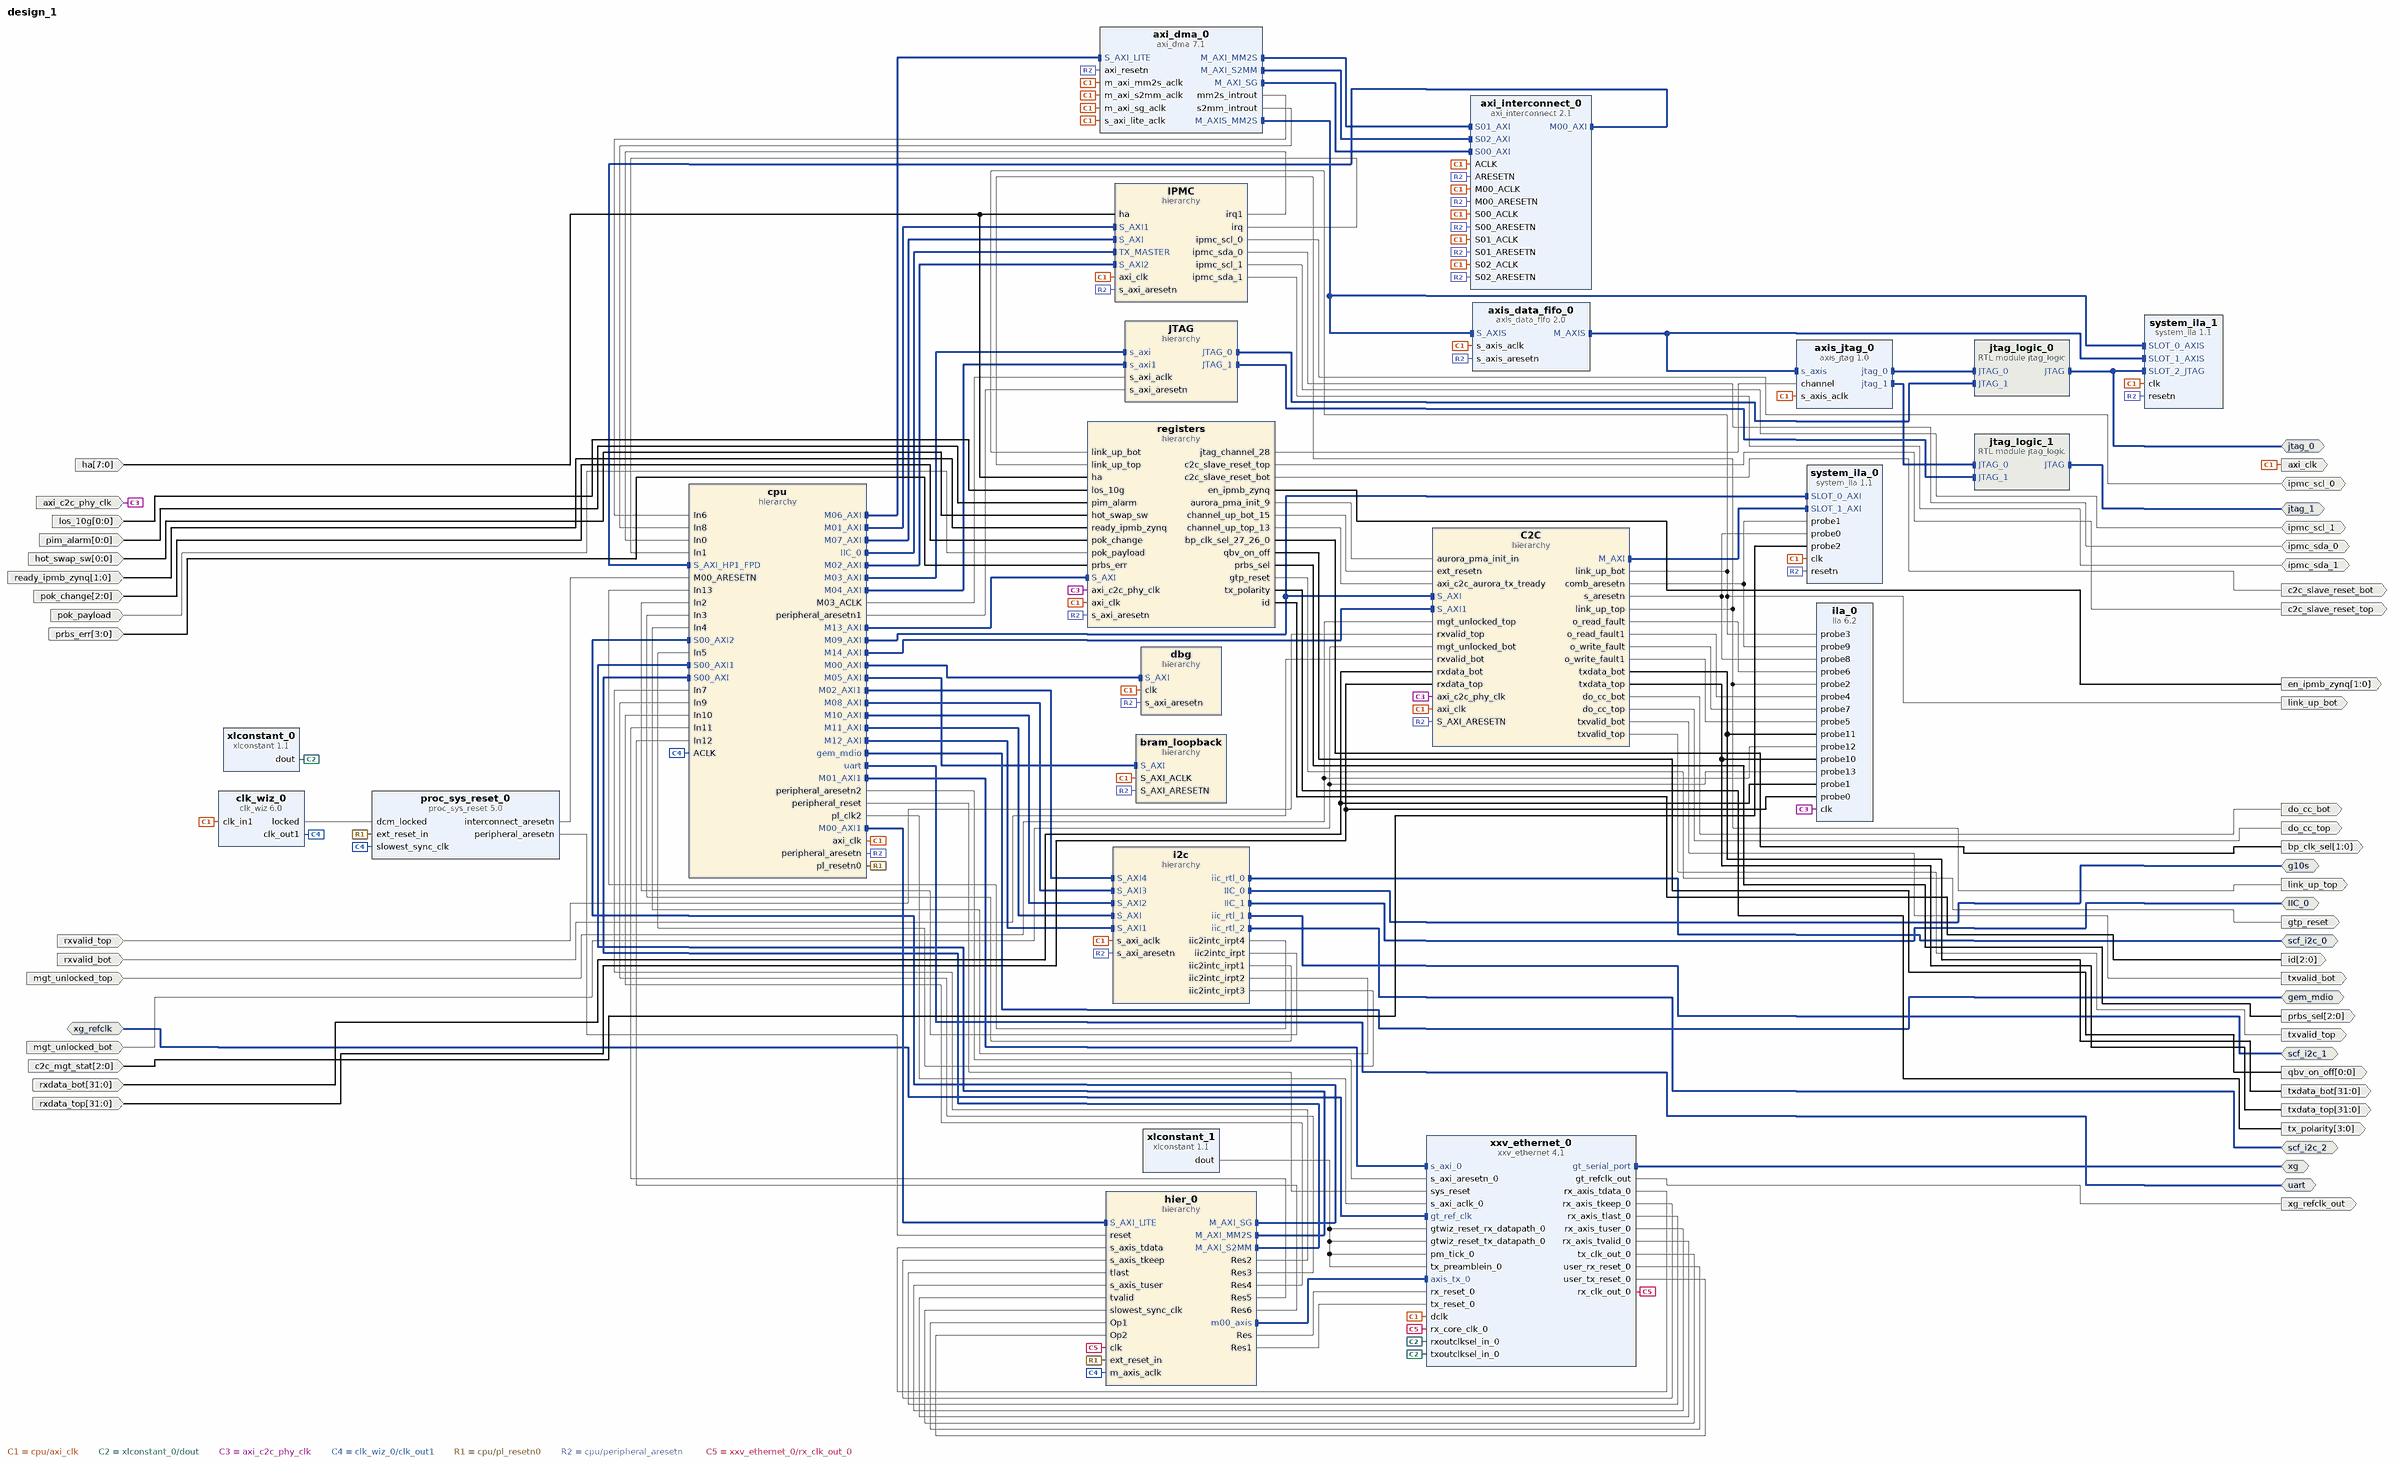
[diagram p0: block diagram of the top level]
# Vivado block design design_1, xck26-sfvc784-2LV-c, Vivado 2022.2.2
create_bd_design design_1

create_bd_intf_port -mode Master -vlnv xilinx.com:interface:iic_rtl:1.0 g10s
create_bd_intf_port -mode Master -vlnv xilinx.com:interface:mdio_rtl:1.0 gem_mdio
create_bd_intf_port -mode Master -vlnv xilinx.com:interface:jtag_rtl:2.0 jtag_0
create_bd_intf_port -mode Master -vlnv xilinx.com:interface:jtag_rtl:2.0 jtag_1
create_bd_intf_port -mode Master -vlnv xilinx.com:interface:iic_rtl:1.0 scf_i2c_0
create_bd_intf_port -mode Master -vlnv xilinx.com:interface:iic_rtl:1.0 scf_i2c_1
create_bd_intf_port -mode Master -vlnv xilinx.com:interface:iic_rtl:1.0 scf_i2c_2
create_bd_intf_port -mode Master -vlnv xilinx.com:interface:uart_rtl:1.0 uart
create_bd_intf_port -mode Master -vlnv xilinx.com:interface:gt_rtl:1.0 xg
create_bd_intf_port -mode Slave -vlnv xilinx.com:interface:diff_clock_rtl:1.0 xg_refclk
set_property -dict {CONFIG.FREQ_HZ 156250000} [get_bd_intf_ports xg_refclk]
create_bd_intf_port -mode Master -vlnv xilinx.com:interface:iic_rtl:1.0 IIC_0
create_bd_port -dir I -type clk axi_c2c_phy_clk
set_property -dict {CONFIG.FREQ_HZ 93750000 CONFIG.PHASE 0} [get_bd_ports axi_c2c_phy_clk]
create_bd_port -dir O -type clk axi_clk
create_bd_port -dir O -from 1 -to 0 bp_clk_sel
create_bd_port -dir I -from 2 -to 0 c2c_mgt_stat
create_bd_port -dir O -type rst c2c_slave_reset_bot
create_bd_port -dir O -type rst c2c_slave_reset_top
create_bd_port -dir O do_cc_bot
create_bd_port -dir O do_cc_top
create_bd_port -dir O -from 1 -to 0 en_ipmb_zynq
create_bd_port -dir O gtp_reset
create_bd_port -dir I -from 7 -to 0 ha
create_bd_port -dir I -from 0 -to 0 hot_swap_sw
create_bd_port -dir O -from 2 -to 0 id
create_bd_port -dir IO ipmc_scl_0
create_bd_port -dir IO ipmc_scl_1
create_bd_port -dir IO ipmc_sda_0
create_bd_port -dir IO ipmc_sda_1
create_bd_port -dir O link_up_bot
create_bd_port -dir O link_up_top
create_bd_port -dir I -from 0 -to 0 los_10g
create_bd_port -dir I -type rst mgt_unlocked_bot
set_property -dict {CONFIG.POLARITY ACTIVE_HIGH} [get_bd_ports mgt_unlocked_bot]
create_bd_port -dir I -type rst mgt_unlocked_top
set_property -dict {CONFIG.POLARITY ACTIVE_HIGH} [get_bd_ports mgt_unlocked_top]
create_bd_port -dir I -from 0 -to 0 pim_alarm
create_bd_port -dir I -from 2 -to 0 pok_change
create_bd_port -dir I pok_payload
create_bd_port -dir I -from 3 -to 0 prbs_err
create_bd_port -dir O -from 2 -to 0 prbs_sel
create_bd_port -dir O -from 0 -to 0 qbv_on_off
create_bd_port -dir I -from 1 -to 0 ready_ipmb_zynq
create_bd_port -dir I -from 31 -to 0 rxdata_bot
create_bd_port -dir I -from 31 -to 0 rxdata_top
create_bd_port -dir I rxvalid_bot
create_bd_port -dir I rxvalid_top
create_bd_port -dir O -from 3 -to 0 tx_polarity
create_bd_port -dir O -from 31 -to 0 txdata_bot
create_bd_port -dir O -from 31 -to 0 txdata_top
create_bd_port -dir O txvalid_bot
create_bd_port -dir O txvalid_top
create_bd_port -dir O -type clk xg_refclk_out

create_bd_cell -type hier C2C
create_bd_cell -type hier IPMC
create_bd_cell -type hier JTAG
create_bd_cell -type hier bram_loopback
create_bd_cell -type hier cpu
create_bd_cell -type hier dbg
create_bd_cell -type hier i2c
create_bd_cell -type ip -vlnv xilinx.com:ip:ila:6.2 ila_0
set_property -dict [list \
  CONFIG.C_DATA_DEPTH 1024 \
  CONFIG.C_ENABLE_ILA_AXI_MON false \
  CONFIG.C_INPUT_PIPE_STAGES 6 \
  CONFIG.C_MONITOR_TYPE Native \
  CONFIG.C_NUM_OF_PROBES 14 \
  CONFIG.C_PROBE0_WIDTH 32 \
  CONFIG.C_PROBE10_WIDTH 32 \
  CONFIG.C_PROBE11_WIDTH 32 \
  CONFIG.C_PROBE1_WIDTH 32 \
] [get_bd_cells ila_0]
create_bd_cell -type hier registers
create_bd_cell -type module -reference jtag_logic jtag_logic_0
create_bd_cell -type module -reference jtag_logic jtag_logic_1
create_bd_cell -type ip -vlnv user.org:user:axis_jtag:1.0 axis_jtag_0
set_property -dict {CONFIG.C_TCK_CLOCK_RATIO 4} [get_bd_cells axis_jtag_0]
create_bd_cell -type hier hier_0
create_bd_cell -type ip -vlnv xilinx.com:ip:proc_sys_reset:5.0 proc_sys_reset_0
create_bd_cell -type ip -vlnv xilinx.com:ip:axi_dma:7.1 axi_dma_0
set_property -dict [list \
  CONFIG.c_addr_width 64 \
  CONFIG.c_enable_multi_channel 0 \
  CONFIG.c_include_sg 1 \
  CONFIG.c_m_axi_mm2s_data_width 64 \
  CONFIG.c_m_axi_s2mm_data_width 64 \
  CONFIG.c_m_axis_mm2s_tdata_width 64 \
  CONFIG.c_mm2s_burst_size 128 \
  CONFIG.c_s2mm_burst_size 128 \
  CONFIG.c_s_axis_s2mm_tdata_width 64 \
  CONFIG.c_sg_include_stscntrl_strm 0 \
  CONFIG.c_sg_length_width 26 \
] [get_bd_cells axi_dma_0]
create_bd_cell -type ip -vlnv xilinx.com:ip:axi_interconnect:2.1 axi_interconnect_0
set_property -dict {CONFIG.NUM_MI 1 CONFIG.NUM_SI 3} [get_bd_cells axi_interconnect_0]
create_bd_cell -type ip -vlnv xilinx.com:ip:axis_data_fifo:2.0 axis_data_fifo_0
set_property -dict {CONFIG.FIFO_DEPTH 64 CONFIG.TDATA_NUM_BYTES 8} [get_bd_cells axis_data_fifo_0]
create_bd_cell -type ip -vlnv xilinx.com:ip:clk_wiz:6.0 clk_wiz_0
set_property -dict [list \
  CONFIG.CLKOUT1_JITTER 94.863 \
  CONFIG.CLKOUT1_PHASE_ERROR 87.181 \
  CONFIG.CLKOUT1_REQUESTED_OUT_FREQ 300.000 \
  CONFIG.MMCM_CLKOUT0_DIVIDE_F 4.000 \
  CONFIG.PRIM_SOURCE Global_buffer \
  CONFIG.USE_RESET false \
] [get_bd_cells clk_wiz_0]
create_bd_cell -type ip -vlnv xilinx.com:ip:system_ila:1.1 system_ila_0
set_property -dict [list \
  CONFIG.C_DATA_DEPTH 2048 \
  CONFIG.C_MON_TYPE MIX \
  CONFIG.C_NUM_MONITOR_SLOTS 2 \
  CONFIG.C_NUM_OF_PROBES 3 \
] [get_bd_cells system_ila_0]
create_bd_cell -type ip -vlnv xilinx.com:ip:system_ila:1.1 system_ila_1
set_property -dict [list \
  CONFIG.C_DATA_DEPTH 2048 \
  CONFIG.C_INPUT_PIPE_STAGES 6 \
  CONFIG.C_MON_TYPE INTERFACE \
  CONFIG.C_NUM_MONITOR_SLOTS 3 \
  CONFIG.C_NUM_OF_PROBES 3 \
  CONFIG.C_SLOT 2 \
  CONFIG.C_SLOT_0_INTF_TYPE xilinx.com:interface:axis_rtl:1.0 \
  CONFIG.C_SLOT_1_INTF_TYPE xilinx.com:interface:axis_rtl:1.0 \
  CONFIG.C_SLOT_2_INTF_TYPE xilinx.com:interface:jtag_rtl:2.0 \
] [get_bd_cells system_ila_1]
create_bd_cell -type ip -vlnv xilinx.com:ip:xlconstant:1.1 xlconstant_0
set_property -dict {CONFIG.CONST_VAL 5 CONFIG.CONST_WIDTH 3} [get_bd_cells xlconstant_0]
create_bd_cell -type ip -vlnv xilinx.com:ip:xlconstant:1.1 xlconstant_1
set_property -dict {CONFIG.CONST_VAL 0 CONFIG.CONST_WIDTH 56} [get_bd_cells xlconstant_1]
create_bd_cell -type ip -vlnv xilinx.com:ip:xxv_ethernet:4.1 xxv_ethernet_0
set_property -dict {CONFIG.BASE_R_KR BASE-R} [get_bd_cells xxv_ethernet_0]

# ---- hierarchy /C2C ----
current_bd_instance /C2C
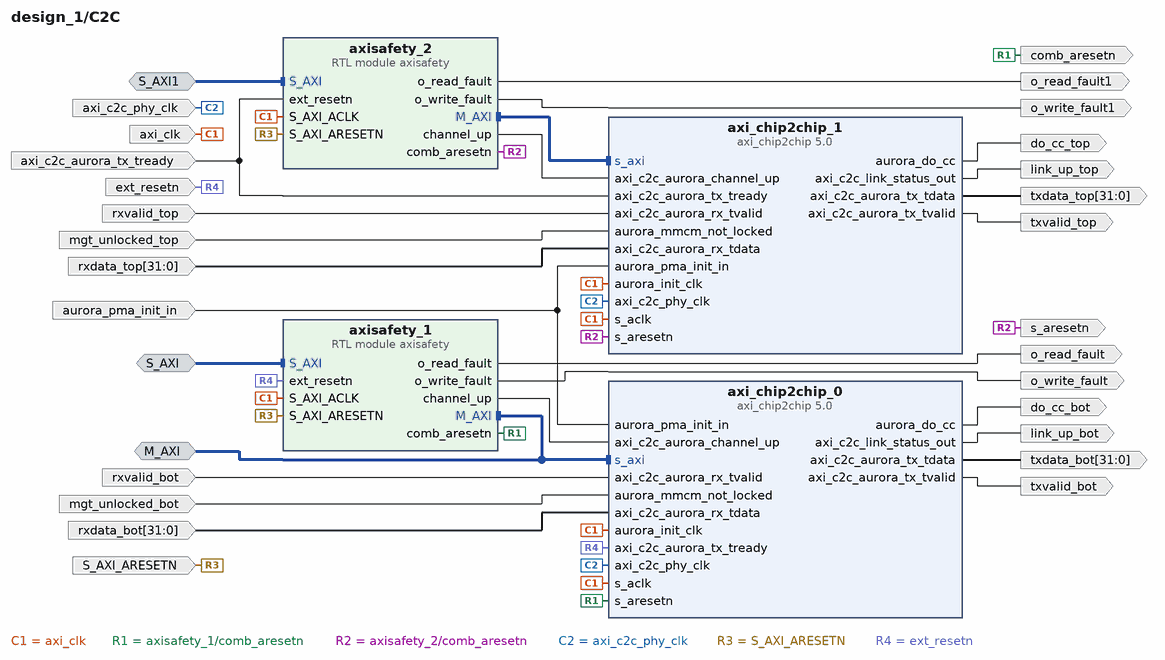
[diagram p1: block diagram inside /C2C]
create_bd_intf_pin -mode Monitor -vlnv xilinx.com:interface:aximm_rtl:1.0 M_AXI
create_bd_intf_pin -mode Slave -vlnv xilinx.com:interface:aximm_rtl:1.0 S_AXI
create_bd_intf_pin -mode Slave -vlnv xilinx.com:interface:aximm_rtl:1.0 S_AXI1
create_bd_pin -dir I -type rst S_AXI_ARESETN
create_bd_pin -dir I -type rst aurora_pma_init_in
create_bd_pin -dir I axi_c2c_aurora_tx_tready
create_bd_pin -dir I -type clk axi_c2c_phy_clk
create_bd_pin -dir I -type clk axi_clk
create_bd_pin -dir O -type rst comb_aresetn
create_bd_pin -dir O do_cc_bot
create_bd_pin -dir O do_cc_top
create_bd_pin -dir I -type rst ext_resetn
create_bd_pin -dir O link_up_bot
create_bd_pin -dir O link_up_top
create_bd_pin -dir I -type rst mgt_unlocked_bot
create_bd_pin -dir I -type rst mgt_unlocked_top
create_bd_pin -dir O o_read_fault
create_bd_pin -dir O o_read_fault1
create_bd_pin -dir O o_write_fault
create_bd_pin -dir O o_write_fault1
create_bd_pin -dir I -from 31 -to 0 rxdata_bot
create_bd_pin -dir I -from 31 -to 0 rxdata_top
create_bd_pin -dir I rxvalid_bot
create_bd_pin -dir I rxvalid_top
create_bd_pin -dir O -type rst s_aresetn
create_bd_pin -dir O -from 31 -to 0 txdata_bot
create_bd_pin -dir O -from 31 -to 0 txdata_top
create_bd_pin -dir O txvalid_bot
create_bd_pin -dir O txvalid_top

create_bd_cell -type ip -vlnv xilinx.com:ip:axi_chip2chip:5.0 axi_chip2chip_0
set_property -dict [list \
  CONFIG.C_ECC_ENABLE false \
  CONFIG.C_INCLUDE_AXILITE 0 \
  CONFIG.C_INTERFACE_MODE 1 \
  CONFIG.C_INTERFACE_TYPE 3 \
] [get_bd_cells axi_chip2chip_0]
create_bd_cell -type ip -vlnv xilinx.com:ip:axi_chip2chip:5.0 axi_chip2chip_1
set_property -dict [list \
  CONFIG.C_ECC_ENABLE false \
  CONFIG.C_INCLUDE_AXILITE 0 \
  CONFIG.C_INTERFACE_MODE 1 \
  CONFIG.C_INTERFACE_TYPE 3 \
] [get_bd_cells axi_chip2chip_1]
create_bd_cell -type module -reference axisafety axisafety_1
set_property -dict [list \
  CONFIG.C_S_AXI_ADDR_WIDTH 28 \
  CONFIG.C_S_AXI_ID_WIDTH 6 \
  CONFIG.OPT_SELF_RESET 1 \
  CONFIG.OPT_TIMEOUT 100000 \
] [get_bd_cells axisafety_1]
create_bd_cell -type module -reference axisafety axisafety_2
set_property -dict [list \
  CONFIG.C_S_AXI_ADDR_WIDTH 28 \
  CONFIG.C_S_AXI_ID_WIDTH 6 \
  CONFIG.OPT_SELF_RESET 1 \
  CONFIG.OPT_TIMEOUT 100000 \
] [get_bd_cells axisafety_2]

# ---- hierarchy /IPMC ----
current_bd_instance /IPMC
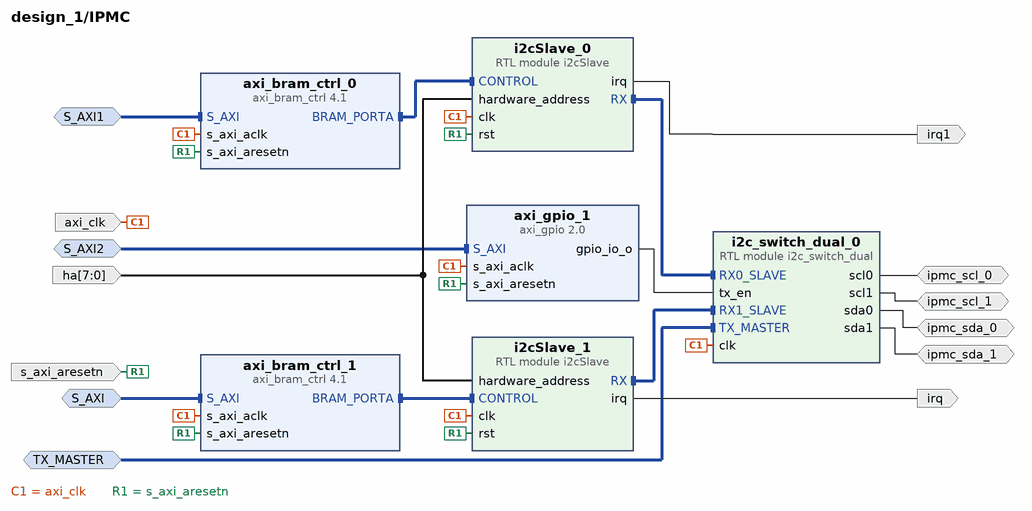
[diagram p2: block diagram inside /IPMC]
create_bd_intf_pin -mode Slave -vlnv xilinx.com:interface:aximm_rtl:1.0 S_AXI
create_bd_intf_pin -mode Slave -vlnv xilinx.com:interface:aximm_rtl:1.0 S_AXI1
create_bd_intf_pin -mode Slave -vlnv xilinx.com:interface:aximm_rtl:1.0 S_AXI2
create_bd_intf_pin -mode Slave -vlnv xilinx.com:interface:iic_rtl:1.0 TX_MASTER
create_bd_pin -dir I -type clk axi_clk
create_bd_pin -dir I -from 7 -to 0 ha
create_bd_pin -dir IO ipmc_scl_0
create_bd_pin -dir IO ipmc_scl_1
create_bd_pin -dir IO ipmc_sda_0
create_bd_pin -dir IO ipmc_sda_1
create_bd_pin -dir O -type intr irq
create_bd_pin -dir O -type intr irq1
create_bd_pin -dir I -type rst s_axi_aresetn

create_bd_cell -type module -reference i2c_switch_dual i2c_switch_dual_0
create_bd_cell -type ip -vlnv xilinx.com:ip:axi_bram_ctrl:4.1 axi_bram_ctrl_0
set_property -dict {CONFIG.SINGLE_PORT_BRAM 1} [get_bd_cells axi_bram_ctrl_0]
create_bd_cell -type ip -vlnv xilinx.com:ip:axi_bram_ctrl:4.1 axi_bram_ctrl_1
set_property -dict {CONFIG.SINGLE_PORT_BRAM 1} [get_bd_cells axi_bram_ctrl_1]
create_bd_cell -type ip -vlnv xilinx.com:ip:axi_gpio:2.0 axi_gpio_1
set_property -dict {CONFIG.C_ALL_OUTPUTS 1 CONFIG.C_GPIO_WIDTH 2} [get_bd_cells axi_gpio_1]
create_bd_cell -type module -reference i2cSlave i2cSlave_0
create_bd_cell -type module -reference i2cSlave i2cSlave_1

# ---- hierarchy /JTAG ----
current_bd_instance /JTAG
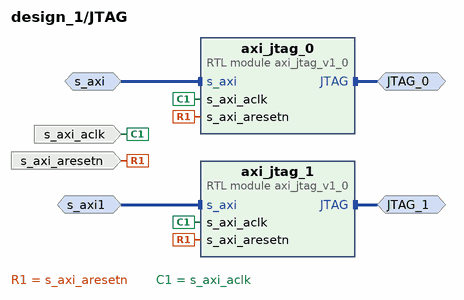
[diagram p3: block diagram inside /JTAG]
create_bd_intf_pin -mode Master -vlnv xilinx.com:interface:jtag_rtl:2.0 JTAG_0
create_bd_intf_pin -mode Master -vlnv xilinx.com:interface:jtag_rtl:2.0 JTAG_1
create_bd_intf_pin -mode Slave -vlnv xilinx.com:interface:aximm_rtl:1.0 s_axi
create_bd_intf_pin -mode Slave -vlnv xilinx.com:interface:aximm_rtl:1.0 s_axi1
create_bd_pin -dir I -type clk s_axi_aclk
create_bd_pin -dir I -type rst s_axi_aresetn

create_bd_cell -type module -reference axi_jtag_v1_0 axi_jtag_0
set_property -dict {CONFIG.C_TCK_CLOCK_RATIO 20} [get_bd_cells axi_jtag_0]
create_bd_cell -type module -reference axi_jtag_v1_0 axi_jtag_1
set_property -dict {CONFIG.C_TCK_CLOCK_RATIO 20} [get_bd_cells axi_jtag_1]

# ---- hierarchy /bram_loopback ----
current_bd_instance /bram_loopback
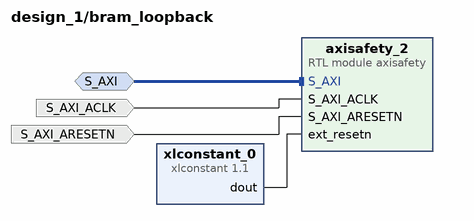
[diagram p4: block diagram inside /bram_loopback]
create_bd_intf_pin -mode Slave -vlnv xilinx.com:interface:aximm_rtl:1.0 S_AXI
create_bd_pin -dir I -type clk S_AXI_ACLK
create_bd_pin -dir I -type rst S_AXI_ARESETN

create_bd_cell -type ip -vlnv xilinx.com:ip:xlconstant:1.1 xlconstant_0
create_bd_cell -type module -reference axisafety axisafety_2
set_property -dict [list \
  CONFIG.AW 28 \
  CONFIG.C_S_AXI_ADDR_WIDTH 28 \
  CONFIG.C_S_AXI_ID_WIDTH 6 \
  CONFIG.OPT_SELF_RESET 1 \
  CONFIG.OPT_TIMEOUT 100000 \
] [get_bd_cells axisafety_2]

# ---- hierarchy /cpu ----
current_bd_instance /cpu
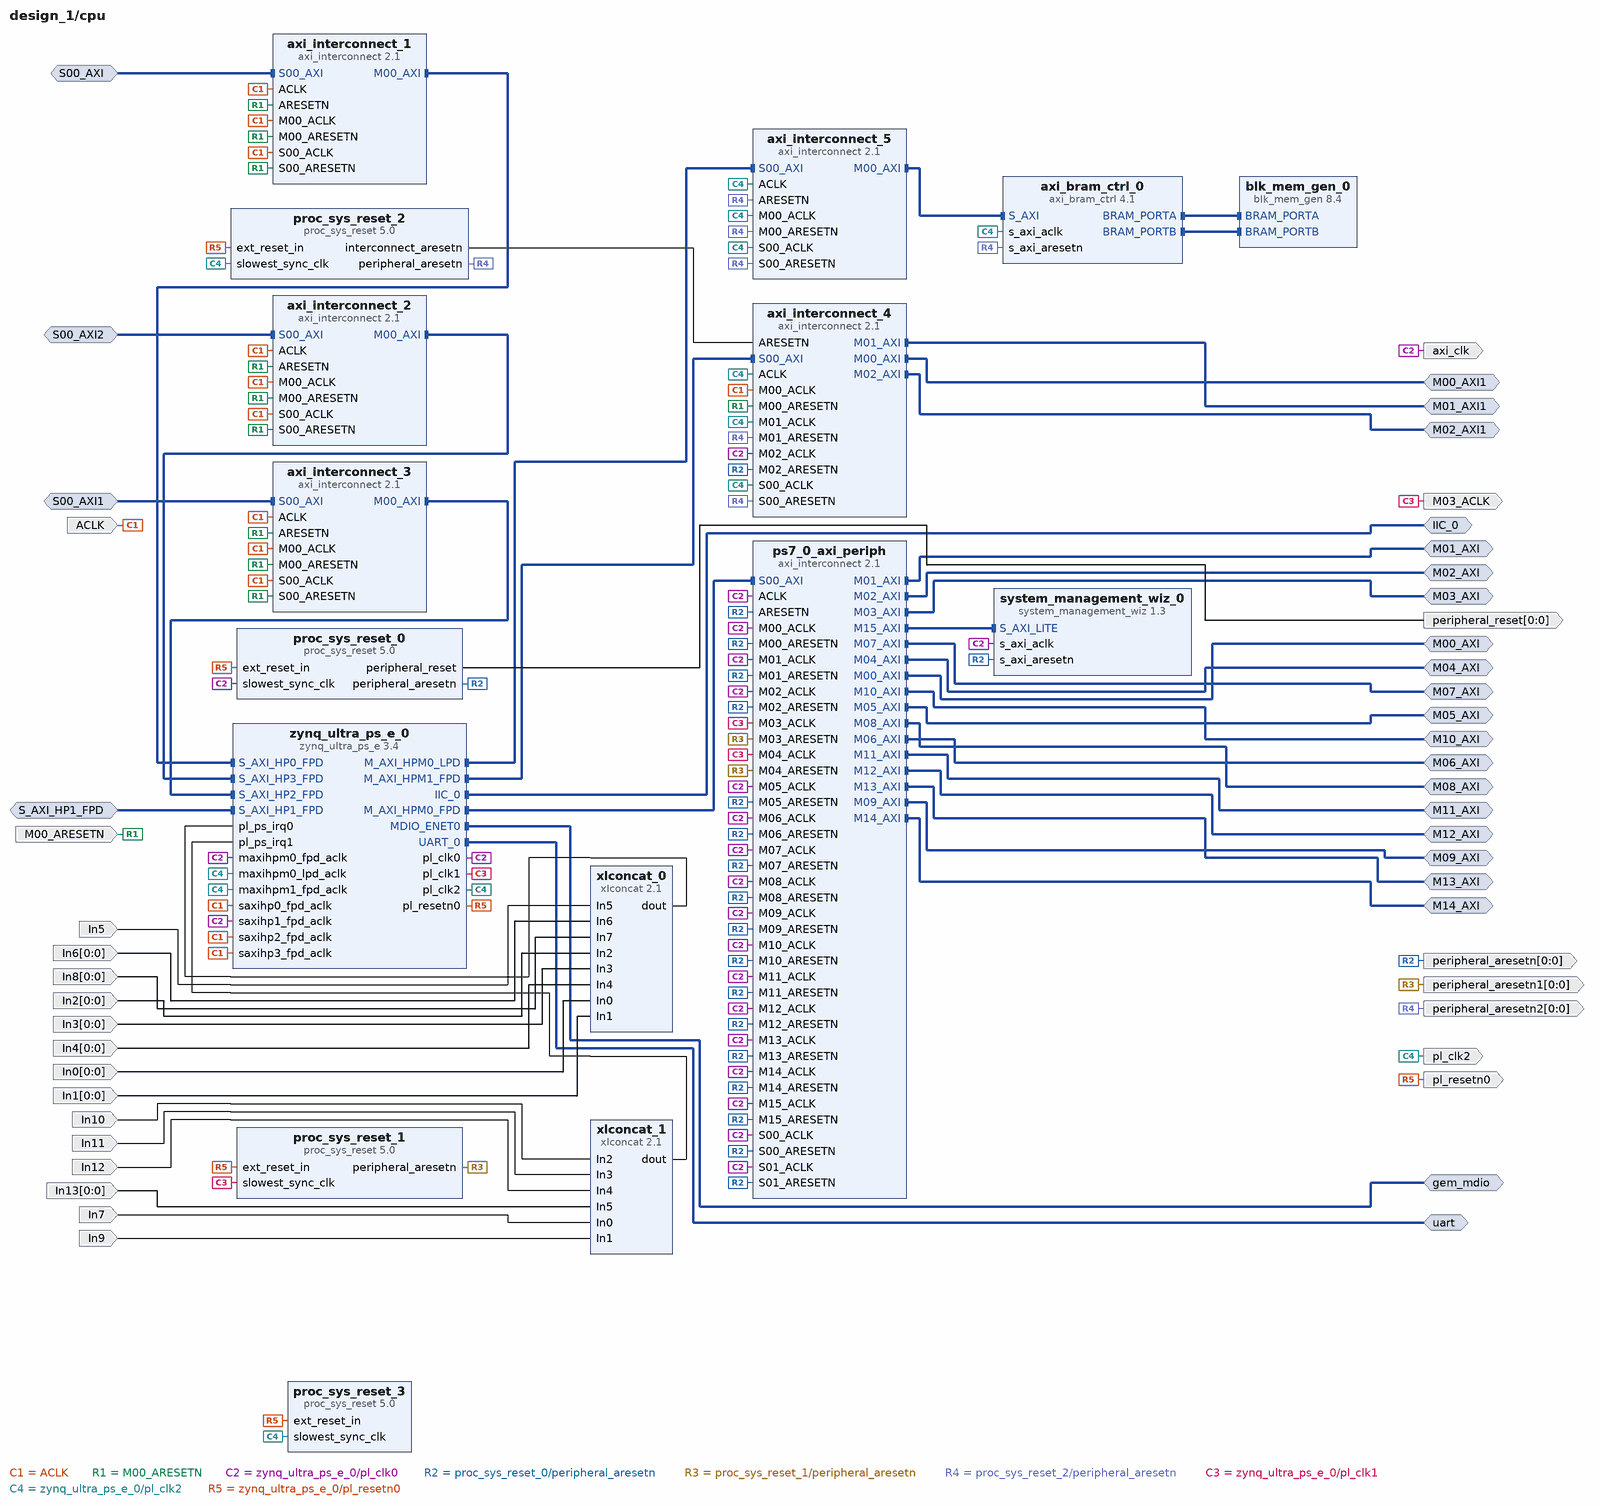
[diagram p5: block diagram inside /cpu]
create_bd_intf_pin -mode Master -vlnv xilinx.com:interface:iic_rtl:1.0 IIC_0
create_bd_intf_pin -mode Master -vlnv xilinx.com:interface:aximm_rtl:1.0 M00_AXI
create_bd_intf_pin -mode Master -vlnv xilinx.com:interface:aximm_rtl:1.0 M01_AXI
create_bd_intf_pin -mode Master -vlnv xilinx.com:interface:aximm_rtl:1.0 M02_AXI
create_bd_intf_pin -mode Master -vlnv xilinx.com:interface:aximm_rtl:1.0 M03_AXI
create_bd_intf_pin -mode Master -vlnv xilinx.com:interface:aximm_rtl:1.0 M04_AXI
create_bd_intf_pin -mode Master -vlnv xilinx.com:interface:aximm_rtl:1.0 M05_AXI
create_bd_intf_pin -mode Master -vlnv xilinx.com:interface:aximm_rtl:1.0 M06_AXI
create_bd_intf_pin -mode Master -vlnv xilinx.com:interface:aximm_rtl:1.0 M07_AXI
create_bd_intf_pin -mode Master -vlnv xilinx.com:interface:aximm_rtl:1.0 M08_AXI
create_bd_intf_pin -mode Master -vlnv xilinx.com:interface:aximm_rtl:1.0 M09_AXI
create_bd_intf_pin -mode Master -vlnv xilinx.com:interface:aximm_rtl:1.0 M10_AXI
create_bd_intf_pin -mode Master -vlnv xilinx.com:interface:aximm_rtl:1.0 M11_AXI
create_bd_intf_pin -mode Master -vlnv xilinx.com:interface:aximm_rtl:1.0 M12_AXI
create_bd_intf_pin -mode Master -vlnv xilinx.com:interface:aximm_rtl:1.0 M13_AXI
create_bd_intf_pin -mode Master -vlnv xilinx.com:interface:aximm_rtl:1.0 M14_AXI
create_bd_intf_pin -mode Master -vlnv xilinx.com:interface:mdio_rtl:1.0 gem_mdio
create_bd_intf_pin -mode Master -vlnv xilinx.com:interface:uart_rtl:1.0 uart
create_bd_intf_pin -mode Slave -vlnv xilinx.com:interface:aximm_rtl:1.0 S_AXI_HP1_FPD
create_bd_intf_pin -mode Slave -vlnv xilinx.com:interface:aximm_rtl:1.0 S00_AXI
create_bd_intf_pin -mode Slave -vlnv xilinx.com:interface:aximm_rtl:1.0 S00_AXI1
create_bd_intf_pin -mode Slave -vlnv xilinx.com:interface:aximm_rtl:1.0 S00_AXI2
create_bd_intf_pin -mode Master -vlnv xilinx.com:interface:aximm_rtl:1.0 M01_AXI1
create_bd_intf_pin -mode Master -vlnv xilinx.com:interface:aximm_rtl:1.0 M00_AXI1
create_bd_intf_pin -mode Master -vlnv xilinx.com:interface:aximm_rtl:1.0 M02_AXI1
create_bd_pin -dir I -from 0 -to 0 In0
create_bd_pin -dir I -from 0 -to 0 In1
create_bd_pin -dir I -from 0 -to 0 In2
create_bd_pin -dir I -from 0 -to 0 In3
create_bd_pin -dir I -from 0 -to 0 In4
create_bd_pin -dir I -type intr In5
create_bd_pin -dir O -type clk M03_ACLK
create_bd_pin -dir O -type clk axi_clk
create_bd_pin -dir O -from 0 -to 0 -type rst peripheral_aresetn
create_bd_pin -dir O -from 0 -to 0 -type rst peripheral_aresetn1
create_bd_pin -dir O -from 0 -to 0 -type rst peripheral_reset
create_bd_pin -dir O -type clk pl_clk2
create_bd_pin -dir O -type rst pl_resetn0
create_bd_pin -dir I -from 0 -to 0 In6
create_bd_pin -dir I -from 0 -to 0 In8
create_bd_pin -dir I -type rst M00_ARESETN
create_bd_pin -dir O -from 0 -to 0 -type rst peripheral_aresetn2
create_bd_pin -dir I In7
create_bd_pin -dir I In9
create_bd_pin -dir I In10
create_bd_pin -dir I In11
create_bd_pin -dir I In12
create_bd_pin -dir I -type clk ACLK
create_bd_pin -dir I -from 0 -to 0 -type intr In13

create_bd_cell -type ip -vlnv xilinx.com:ip:proc_sys_reset:5.0 proc_sys_reset_0
create_bd_cell -type ip -vlnv xilinx.com:ip:proc_sys_reset:5.0 proc_sys_reset_1
create_bd_cell -type ip -vlnv xilinx.com:ip:xlconcat:2.1 xlconcat_0
set_property -dict {CONFIG.NUM_PORTS 8} [get_bd_cells xlconcat_0]
create_bd_cell -type ip -vlnv xilinx.com:ip:xlconcat:2.1 xlconcat_1
set_property -dict {CONFIG.NUM_PORTS 6} [get_bd_cells xlconcat_1]
create_bd_cell -type ip -vlnv xilinx.com:ip:proc_sys_reset:5.0 proc_sys_reset_2
create_bd_cell -type ip -vlnv xilinx.com:ip:proc_sys_reset:5.0 proc_sys_reset_3
create_bd_cell -type ip -vlnv xilinx.com:ip:blk_mem_gen:8.4 blk_mem_gen_0
set_property -dict [list \
  CONFIG.EN_SAFETY_CKT false \
  CONFIG.Enable_B Use_ENB_Pin \
  CONFIG.Memory_Type True_Dual_Port_RAM \
  CONFIG.Port_B_Clock 100 \
  CONFIG.Port_B_Enable_Rate 100 \
  CONFIG.Port_B_Write_Rate 50 \
  CONFIG.Use_RSTB_Pin true \
] [get_bd_cells blk_mem_gen_0]
create_bd_cell -type ip -vlnv xilinx.com:ip:axi_bram_ctrl:4.1 axi_bram_ctrl_0
create_bd_cell -type ip -vlnv xilinx.com:ip:axi_interconnect:2.1 axi_interconnect_1
set_property -dict [list \
  CONFIG.ENABLE_ADVANCED_OPTIONS 1 \
  CONFIG.NUM_MI 1 \
  CONFIG.S00_HAS_DATA_FIFO 1 \
  CONFIG.S00_HAS_REGSLICE 4 \
] [get_bd_cells axi_interconnect_1]
create_bd_cell -type ip -vlnv xilinx.com:ip:axi_interconnect:2.1 axi_interconnect_2
set_property -dict [list \
  CONFIG.ENABLE_ADVANCED_OPTIONS 1 \
  CONFIG.NUM_MI 1 \
  CONFIG.S00_HAS_DATA_FIFO 1 \
  CONFIG.S00_HAS_REGSLICE 4 \
] [get_bd_cells axi_interconnect_2]
create_bd_cell -type ip -vlnv xilinx.com:ip:axi_interconnect:2.1 axi_interconnect_4
set_property -dict {CONFIG.NUM_MI 3} [get_bd_cells axi_interconnect_4]
create_bd_cell -type ip -vlnv xilinx.com:ip:axi_interconnect:2.1 axi_interconnect_3
set_property -dict [list \
  CONFIG.ENABLE_ADVANCED_OPTIONS 1 \
  CONFIG.NUM_MI 1 \
  CONFIG.S00_HAS_DATA_FIFO 1 \
  CONFIG.S00_HAS_REGSLICE 4 \
] [get_bd_cells axi_interconnect_3]
create_bd_cell -type ip -vlnv xilinx.com:ip:axi_interconnect:2.1 axi_interconnect_5
set_property -dict {CONFIG.NUM_MI 1} [get_bd_cells axi_interconnect_5]
create_bd_cell -type ip -vlnv xilinx.com:ip:axi_interconnect:2.1 ps7_0_axi_periph
set_property -dict [list \
  CONFIG.ENABLE_ADVANCED_OPTIONS 1 \
  CONFIG.M00_HAS_REGSLICE 4 \
  CONFIG.M01_HAS_REGSLICE 4 \
  CONFIG.M02_HAS_REGSLICE 4 \
  CONFIG.M03_HAS_REGSLICE 4 \
  CONFIG.NUM_MI 16 \
  CONFIG.NUM_SI 2 \
  CONFIG.S00_HAS_DATA_FIFO 2 \
  CONFIG.S00_HAS_REGSLICE 4 \
  CONFIG.S01_HAS_DATA_FIFO 2 \
  CONFIG.S01_HAS_REGSLICE 4 \
  CONFIG.STRATEGY 2 \
] [get_bd_cells ps7_0_axi_periph]
create_bd_cell -type ip -vlnv xilinx.com:ip:zynq_ultra_ps_e:3.4 zynq_ultra_ps_e_0
set_property -dict [list \
  CONFIG.CAN0_BOARD_INTERFACE custom \
  CONFIG.CAN1_BOARD_INTERFACE custom \
  CONFIG.CSU_BOARD_INTERFACE custom \
  CONFIG.DP_BOARD_INTERFACE custom \
  CONFIG.GEM0_BOARD_INTERFACE custom \
  CONFIG.GEM1_BOARD_INTERFACE custom \
  CONFIG.GEM2_BOARD_INTERFACE custom \
  CONFIG.GEM3_BOARD_INTERFACE custom \
  CONFIG.GPIO_BOARD_INTERFACE custom \
  CONFIG.IIC0_BOARD_INTERFACE custom \
  CONFIG.IIC1_BOARD_INTERFACE custom \
  CONFIG.NAND_BOARD_INTERFACE custom \
  CONFIG.PCIE_BOARD_INTERFACE custom \
  CONFIG.PJTAG_BOARD_INTERFACE custom \
  CONFIG.PMU_BOARD_INTERFACE custom \
  CONFIG.PSU_BANK_0_IO_STANDARD LVCMOS18 \
  CONFIG.PSU_BANK_1_IO_STANDARD LVCMOS18 \
  CONFIG.PSU_BANK_2_IO_STANDARD LVCMOS18 \
  CONFIG.PSU_BANK_3_IO_STANDARD LVCMOS18 \
  CONFIG.PSU_USB3__DUAL_CLOCK_ENABLE 0 \
  CONFIG.PSU__CAN1__PERIPHERAL__ENABLE 0 \
  CONFIG.PSU__CRF_APB__ACPU_CTRL__FREQMHZ 1333.333 \
  CONFIG.PSU__CRF_APB__ACPU_CTRL__SRCSEL APLL \
  CONFIG.PSU__CRF_APB__APLL_CTRL__SRCSEL PSS_REF_CLK \
  CONFIG.PSU__CRF_APB__APLL_FRAC_CFG__ENABLED 1 \
  CONFIG.PSU__CRF_APB__DBG_FPD_CTRL__FREQMHZ 250 \
  CONFIG.PSU__CRF_APB__DBG_FPD_CTRL__SRCSEL IOPLL \
  CONFIG.PSU__CRF_APB__DBG_TRACE_CTRL__FREQMHZ 250 \
  CONFIG.PSU__CRF_APB__DBG_TRACE_CTRL__SRCSEL IOPLL \
  CONFIG.PSU__CRF_APB__DBG_TSTMP_CTRL__FREQMHZ 250 \
  CONFIG.PSU__CRF_APB__DBG_TSTMP_CTRL__SRCSEL IOPLL \
  CONFIG.PSU__CRF_APB__DDR_CTRL__FREQMHZ 1200 \
  CONFIG.PSU__CRF_APB__DDR_CTRL__SRCSEL DPLL \
  CONFIG.PSU__CRF_APB__DPDMA_REF_CTRL__FREQMHZ 600 \
  CONFIG.PSU__CRF_APB__DPDMA_REF_CTRL__SRCSEL APLL \
  CONFIG.PSU__CRF_APB__DPLL_CTRL__SRCSEL PSS_REF_CLK \
  CONFIG.PSU__CRF_APB__DP_AUDIO_REF_CTRL__SRCSEL RPLL \
  CONFIG.PSU__CRF_APB__DP_STC_REF_CTRL__SRCSEL RPLL \
  CONFIG.PSU__CRF_APB__DP_VIDEO_REF_CTRL__SRCSEL VPLL \
  CONFIG.PSU__CRF_APB__GDMA_REF_CTRL__FREQMHZ 600 \
  CONFIG.PSU__CRF_APB__GDMA_REF_CTRL__SRCSEL DPLL \
  CONFIG.PSU__CRF_APB__GPU_REF_CTRL__FREQMHZ 600 \
  CONFIG.PSU__CRF_APB__GPU_REF_CTRL__SRCSEL IOPLL \
  CONFIG.PSU__CRF_APB__TOPSW_LSBUS_CTRL__FREQMHZ 100 \
  CONFIG.PSU__CRF_APB__TOPSW_LSBUS_CTRL__SRCSEL IOPLL \
  CONFIG.PSU__CRF_APB__TOPSW_MAIN_CTRL__FREQMHZ 533.33 \
  CONFIG.PSU__CRF_APB__TOPSW_MAIN_CTRL__SRCSEL DPLL \
  CONFIG.PSU__CRF_APB__VPLL_CTRL__SRCSEL PSS_REF_CLK \
  CONFIG.PSU__CRL_APB__ADMA_REF_CTRL__FREQMHZ 500 \
  CONFIG.PSU__CRL_APB__ADMA_REF_CTRL__SRCSEL IOPLL \
  CONFIG.PSU__CRL_APB__CAN1_REF_CTRL__FREQMHZ 100 \
  CONFIG.PSU__CRL_APB__CAN1_REF_CTRL__SRCSEL IOPLL \
  CONFIG.PSU__CRL_APB__CPU_R5_CTRL__FREQMHZ 533.333 \
  CONFIG.PSU__CRL_APB__CPU_R5_CTRL__SRCSEL RPLL \
  CONFIG.PSU__CRL_APB__DBG_LPD_CTRL__FREQMHZ 250 \
  CONFIG.PSU__CRL_APB__DBG_LPD_CTRL__SRCSEL IOPLL \
  CONFIG.PSU__CRL_APB__GEM3_REF_CTRL__FREQMHZ 125 \
  CONFIG.PSU__CRL_APB__GEM3_REF_CTRL__SRCSEL IOPLL \
  CONFIG.PSU__CRL_APB__I2C0_REF_CTRL__FREQMHZ 100 \
  CONFIG.PSU__CRL_APB__I2C0_REF_CTRL__SRCSEL IOPLL \
  CONFIG.PSU__CRL_APB__I2C1_REF_CTRL__FREQMHZ 100 \
  CONFIG.PSU__CRL_APB__I2C1_REF_CTRL__SRCSEL IOPLL \
  CONFIG.PSU__CRL_APB__IOPLL_CTRL__SRCSEL PSS_REF_CLK \
  CONFIG.PSU__CRL_APB__IOU_SWITCH_CTRL__FREQMHZ 250 \
  CONFIG.PSU__CRL_APB__IOU_SWITCH_CTRL__SRCSEL IOPLL \
  CONFIG.PSU__CRL_APB__LPD_LSBUS_CTRL__FREQMHZ 100 \
  CONFIG.PSU__CRL_APB__LPD_LSBUS_CTRL__SRCSEL IOPLL \
  CONFIG.PSU__CRL_APB__LPD_SWITCH_CTRL__FREQMHZ 500 \
  CONFIG.PSU__CRL_APB__LPD_SWITCH_CTRL__SRCSEL IOPLL \
  CONFIG.PSU__CRL_APB__PCAP_CTRL__FREQMHZ 200 \
  CONFIG.PSU__CRL_APB__PCAP_CTRL__SRCSEL IOPLL \
  CONFIG.PSU__CRL_APB__PL0_REF_CTRL__FREQMHZ 100 \
  CONFIG.PSU__CRL_APB__PL0_REF_CTRL__SRCSEL IOPLL \
  CONFIG.PSU__CRL_APB__PL1_REF_CTRL__FREQMHZ 200 \
  CONFIG.PSU__CRL_APB__PL2_REF_CTRL__FREQMHZ 125 \
  CONFIG.PSU__CRL_APB__QSPI_REF_CTRL__FREQMHZ 125 \
  CONFIG.PSU__CRL_APB__QSPI_REF_CTRL__SRCSEL IOPLL \
  CONFIG.PSU__CRL_APB__RPLL_CTRL__SRCSEL PSS_REF_CLK \
  CONFIG.PSU__CRL_APB__SDIO1_REF_CTRL__FREQMHZ 200 \
  CONFIG.PSU__CRL_APB__SDIO1_REF_CTRL__SRCSEL IOPLL \
  CONFIG.PSU__CRL_APB__SPI1_REF_CTRL__SRCSEL IOPLL \
  CONFIG.PSU__CRL_APB__TIMESTAMP_REF_CTRL__FREQMHZ 100 \
  CONFIG.PSU__CRL_APB__TIMESTAMP_REF_CTRL__SRCSEL IOPLL \
  CONFIG.PSU__CRL_APB__UART0_REF_CTRL__FREQMHZ 100 \
  CONFIG.PSU__CRL_APB__UART0_REF_CTRL__SRCSEL IOPLL \
  CONFIG.PSU__CRL_APB__UART1_REF_CTRL__FREQMHZ 100 \
  CONFIG.PSU__CRL_APB__UART1_REF_CTRL__SRCSEL IOPLL \
  CONFIG.PSU__CRL_APB__USB0_BUS_REF_CTRL__FREQMHZ 250 \
  CONFIG.PSU__CRL_APB__USB0_BUS_REF_CTRL__SRCSEL IOPLL \
  CONFIG.PSU__CRL_APB__USB3_DUAL_REF_CTRL__FREQMHZ 20 \
  CONFIG.PSU__CRL_APB__USB3_DUAL_REF_CTRL__SRCSEL IOPLL \
  CONFIG.PSU__CRL_APB__USB3__ENABLE 0 \
  CONFIG.PSU__CSUPMU__PERIPHERAL__VALID 0 \
  CONFIG.PSU__DDRC__BUS_WIDTH {64 Bit} \
  CONFIG.PSU__DDRC__COMPONENTS Components \
  CONFIG.PSU__DDRC__DEVICE_CAPACITY {8192 MBits} \
  CONFIG.PSU__DDRC__DRAM_WIDTH {16 Bits} \
  CONFIG.PSU__DDRC__ECC Disabled \
  CONFIG.PSU__DDRC__MEMORY_TYPE {DDR 4} \
  CONFIG.PSU__DDRC__SPEED_BIN DDR4_2400R \
  CONFIG.PSU__DDR_HIGH_ADDRESS_GUI_ENABLE 1 \
  CONFIG.PSU__DDR__INTERFACE__FREQMHZ 600.000 \
  CONFIG.PSU__DEVICE_TYPE EV \
  CONFIG.PSU__DISPLAYPORT__PERIPHERAL__ENABLE 0 \
  CONFIG.PSU__DLL__ISUSED 1 \
  CONFIG.PSU__ENET0__GRP_MDIO__ENABLE 1 \
  CONFIG.PSU__ENET0__GRP_MDIO__IO EMIO \
  CONFIG.PSU__ENET0__PERIPHERAL__ENABLE 1 \
  CONFIG.PSU__ENET0__PERIPHERAL__IO {GT Lane0} \
  CONFIG.PSU__ENET1__PERIPHERAL__ENABLE 1 \
  CONFIG.PSU__ENET1__PERIPHERAL__IO {GT Lane1} \
  CONFIG.PSU__ENET3__PERIPHERAL__ENABLE 0 \
  CONFIG.PSU__FPGA_PL0_ENABLE 1 \
  CONFIG.PSU__FPGA_PL1_ENABLE 1 \
  CONFIG.PSU__FPGA_PL2_ENABLE 1 \
  CONFIG.PSU__GEM0__REF_CLK_FREQ 125 \
  CONFIG.PSU__GEM0__REF_CLK_SEL {Ref Clk0} \
  CONFIG.PSU__GEM1__REF_CLK_FREQ 125 \
  CONFIG.PSU__GEM1__REF_CLK_SEL {Ref Clk0} \
  CONFIG.PSU__GEM__TSU__ENABLE 0 \
  CONFIG.PSU__GPIO0_MIO__IO {MIO 0 .. 25} \
  CONFIG.PSU__GPIO0_MIO__PERIPHERAL__ENABLE 1 \
  CONFIG.PSU__GPIO1_MIO__IO {MIO 26 .. 51} \
  CONFIG.PSU__GPIO1_MIO__PERIPHERAL__ENABLE 1 \
  CONFIG.PSU__I2C0__PERIPHERAL__ENABLE 1 \
  CONFIG.PSU__I2C0__PERIPHERAL__IO EMIO \
  CONFIG.PSU__I2C1__PERIPHERAL__ENABLE 0 \
  CONFIG.PSU__IOU_SLCR__IOU_TTC_APB_CLK__TTC0_SEL APB \
  CONFIG.PSU__IOU_SLCR__IOU_TTC_APB_CLK__TTC1_SEL APB \
  CONFIG.PSU__IOU_SLCR__IOU_TTC_APB_CLK__TTC2_SEL APB \
  CONFIG.PSU__IOU_SLCR__IOU_TTC_APB_CLK__TTC3_SEL APB \
  CONFIG.PSU__LPD_SLCR__CSUPMU__FREQMHZ 100 \
  CONFIG.PSU__MAXIGP0__DATA_WIDTH 64 \
  CONFIG.PSU__MAXIGP2__DATA_WIDTH 128 \
  CONFIG.PSU__OVERRIDE_HPX_QOS 0 \
  CONFIG.PSU__OVERRIDE__BASIC_CLOCK 0 \
  CONFIG.PSU__PMU__GPO2__POLARITY high \
  CONFIG.PSU__PMU__GPO3__POLARITY low \
  CONFIG.PSU__PMU__PERIPHERAL__ENABLE 0 \
  CONFIG.PSU__PRESET_APPLIED 1 \
  CONFIG.PSU__PSS_REF_CLK__FREQMHZ 33.333 \
  CONFIG.PSU__QSPI_COHERENCY 0 \
  CONFIG.PSU__QSPI_ROUTE_THROUGH_FPD 0 \
  CONFIG.PSU__QSPI__GRP_FBCLK__ENABLE 0 \
  CONFIG.PSU__QSPI__PERIPHERAL__DATA_MODE x4 \
  CONFIG.PSU__QSPI__PERIPHERAL__ENABLE 1 \
  CONFIG.PSU__QSPI__PERIPHERAL__IO {MIO 0 .. 5} \
  CONFIG.PSU__QSPI__PERIPHERAL__MODE Single \
  CONFIG.PSU__SATA__PERIPHERAL__ENABLE 0 \
  CONFIG.PSU__SD0__CLK_200_SDR_OTAP_DLY 0x00 \
  CONFIG.PSU__SD0__CLK_50_DDR_ITAP_DLY 0x00 \
  CONFIG.PSU__SD0__CLK_50_DDR_OTAP_DLY 0x00 \
  CONFIG.PSU__SD0__CLK_50_SDR_ITAP_DLY 0x00 \
  CONFIG.PSU__SD0__CLK_50_SDR_OTAP_DLY 0x00 \
  CONFIG.PSU__SD0__DATA_TRANSFER_MODE 8Bit \
  CONFIG.PSU__SD0__GRP_POW__ENABLE 1 \
  CONFIG.PSU__SD0__GRP_POW__IO {MIO 23} \
  CONFIG.PSU__SD0__PERIPHERAL__ENABLE 1 \
  CONFIG.PSU__SD0__PERIPHERAL__IO {MIO 13 .. 22} \
  CONFIG.PSU__SD0__RESET__ENABLE 1 \
  CONFIG.PSU__SD0__SLOT_TYPE eMMC \
  CONFIG.PSU__SD1_COHERENCY 0 \
  CONFIG.PSU__SD1_ROUTE_THROUGH_FPD 0 \
  CONFIG.PSU__SD1__CLK_100_SDR_OTAP_DLY 0x3 \
  CONFIG.PSU__SD1__CLK_200_SDR_OTAP_DLY 0x3 \
  CONFIG.PSU__SD1__CLK_50_DDR_ITAP_DLY 0x3D \
  CONFIG.PSU__SD1__CLK_50_DDR_OTAP_DLY 0x4 \
  CONFIG.PSU__SD1__CLK_50_SDR_ITAP_DLY 0x15 \
  CONFIG.PSU__SD1__CLK_50_SDR_OTAP_DLY 0x5 \
  CONFIG.PSU__SD1__DATA_TRANSFER_MODE 8Bit \
  CONFIG.PSU__SD1__GRP_CD__ENABLE 1 \
  CONFIG.PSU__SD1__GRP_CD__IO {MIO 45} \
  CONFIG.PSU__SD1__GRP_POW__ENABLE 1 \
  CONFIG.PSU__SD1__GRP_POW__IO {MIO 43} \
  CONFIG.PSU__SD1__GRP_WP__ENABLE 0 \
  CONFIG.PSU__SD1__PERIPHERAL__ENABLE 1 \
  CONFIG.PSU__SD1__PERIPHERAL__IO {MIO 39 .. 51} \
  CONFIG.PSU__SD1__SLOT_TYPE {SD 3.0} \
  CONFIG.PSU__SPI1__GRP_SS0__IO {MIO 9} \
  CONFIG.PSU__SPI1__PERIPHERAL__ENABLE 1 \
  CONFIG.PSU__SPI1__PERIPHERAL__IO {MIO 6 .. 11} \
  CONFIG.PSU__SWDT0__CLOCK__ENABLE 0 \
  CONFIG.PSU__SWDT0__PERIPHERAL__ENABLE 1 \
  CONFIG.PSU__SWDT0__RESET__ENABLE 0 \
  CONFIG.PSU__SWDT1__CLOCK__ENABLE 0 \
  CONFIG.PSU__SWDT1__PERIPHERAL__ENABLE 1 \
  CONFIG.PSU__SWDT1__RESET__ENABLE 0 \
  CONFIG.PSU__TSU__BUFG_PORT_PAIR 0 \
  CONFIG.PSU__TTC0__CLOCK__ENABLE 0 \
  CONFIG.PSU__TTC0__PERIPHERAL__ENABLE 1 \
  CONFIG.PSU__TTC0__WAVEOUT__ENABLE 0 \
  CONFIG.PSU__TTC1__CLOCK__ENABLE 0 \
  CONFIG.PSU__TTC1__PERIPHERAL__ENABLE 1 \
  CONFIG.PSU__TTC1__WAVEOUT__ENABLE 0 \
  CONFIG.PSU__TTC2__CLOCK__ENABLE 0 \
  CONFIG.PSU__TTC2__PERIPHERAL__ENABLE 1 \
  CONFIG.PSU__TTC2__WAVEOUT__ENABLE 0 \
  CONFIG.PSU__TTC3__CLOCK__ENABLE 0 \
  CONFIG.PSU__TTC3__PERIPHERAL__ENABLE 1 \
  CONFIG.PSU__TTC3__WAVEOUT__ENABLE 0 \
  CONFIG.PSU__UART0__BAUD_RATE 115200 \
  CONFIG.PSU__UART0__MODEM__ENABLE 0 \
  CONFIG.PSU__UART0__PERIPHERAL__ENABLE 1 \
  CONFIG.PSU__UART0__PERIPHERAL__IO EMIO \
  CONFIG.PSU__UART1__PERIPHERAL__ENABLE 0 \
  CONFIG.PSU__USB0__PERIPHERAL__ENABLE 0 \
  CONFIG.PSU__USE__IRQ0 1 \
  CONFIG.PSU__USE__IRQ1 1 \
  CONFIG.PSU__USE__M_AXI_GP0 1 \
  CONFIG.PSU__USE__M_AXI_GP1 1 \
  CONFIG.PSU__USE__M_AXI_GP2 1 \
  CONFIG.PSU__USE__S_AXI_GP2 1 \
  CONFIG.PSU__USE__S_AXI_GP3 1 \
  CONFIG.PSU__USE__S_AXI_GP4 1 \
  CONFIG.PSU__USE__S_AXI_GP5 1 \
  CONFIG.QSPI_BOARD_INTERFACE custom \
  CONFIG.SATA_BOARD_INTERFACE custom \
  CONFIG.SD0_BOARD_INTERFACE custom \
  CONFIG.SD1_BOARD_INTERFACE custom \
  CONFIG.SPI0_BOARD_INTERFACE custom \
  CONFIG.SPI1_BOARD_INTERFACE custom \
  CONFIG.SUBPRESET1 Custom \
  CONFIG.SUBPRESET2 Custom \
  CONFIG.SWDT0_BOARD_INTERFACE custom \
  CONFIG.SWDT1_BOARD_INTERFACE custom \
  CONFIG.TRACE_BOARD_INTERFACE custom \
  CONFIG.TTC0_BOARD_INTERFACE custom \
  CONFIG.TTC1_BOARD_INTERFACE custom \
  CONFIG.TTC2_BOARD_INTERFACE custom \
  CONFIG.TTC3_BOARD_INTERFACE custom \
  CONFIG.UART0_BOARD_INTERFACE custom \
  CONFIG.UART1_BOARD_INTERFACE custom \
  CONFIG.USB0_BOARD_INTERFACE custom \
  CONFIG.USB1_BOARD_INTERFACE custom \
  CONFIG.preset None \
] [get_bd_cells zynq_ultra_ps_e_0]
# 796 more settings of zynq_ultra_ps_e_0 are not shown: defaults, MIO pin electricals, DDR timing, and values the tool derives
create_bd_cell -type ip -vlnv xilinx.com:ip:system_management_wiz:1.3 system_management_wiz_0
set_property -dict [list \
  CONFIG.ENABLE_VCCPSAUX_ALARM false \
  CONFIG.ENABLE_VCCPSINTFP_ALARM false \
  CONFIG.ENABLE_VCCPSINTLP_ALARM false \
  CONFIG.OT_ALARM false \
  CONFIG.SYSMONE1_STARUP_SELECTION single_channel \
  CONFIG.USER_TEMP_ALARM false \
  CONFIG.VCCAUX_ALARM false \
  CONFIG.VCCINT_ALARM false \
] [get_bd_cells system_management_wiz_0]

# ---- hierarchy /dbg ----
current_bd_instance /dbg
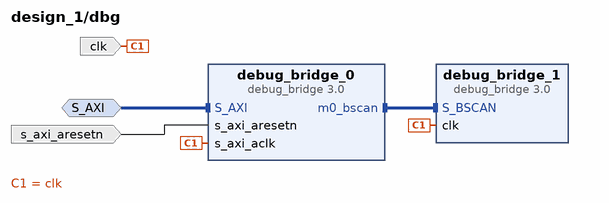
[diagram p6: block diagram inside /dbg]
create_bd_intf_pin -mode Slave -vlnv xilinx.com:interface:aximm_rtl:1.0 S_AXI
create_bd_pin -dir I -type clk clk
create_bd_pin -dir I -type rst s_axi_aresetn

create_bd_cell -type ip -vlnv xilinx.com:ip:debug_bridge:3.0 debug_bridge_0
set_property -dict [list \
  CONFIG.C_BSCAN_MUX 1 \
  CONFIG.C_DEBUG_MODE 2 \
  CONFIG.C_NUM_BS_MASTER 1 \
  CONFIG.C_XVC_HW_ID 0x0001 \
] [get_bd_cells debug_bridge_0]
create_bd_cell -type ip -vlnv xilinx.com:ip:debug_bridge:3.0 debug_bridge_1

# ---- hierarchy /i2c ----
current_bd_instance /i2c
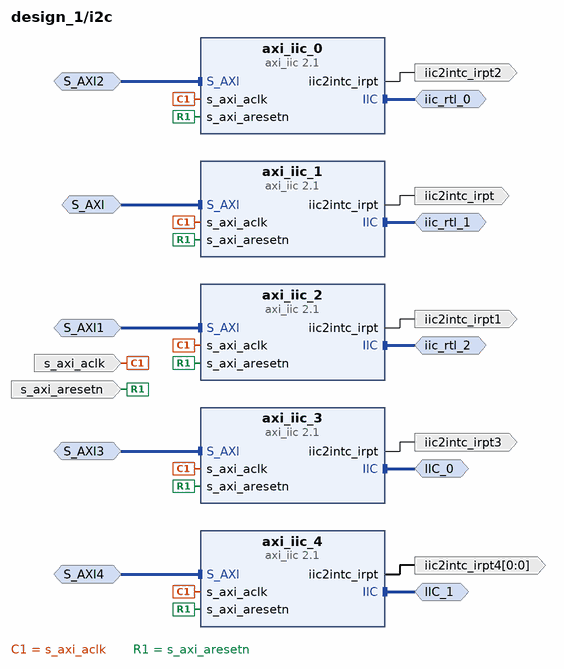
[diagram p7: block diagram inside /i2c]
create_bd_intf_pin -mode Master -vlnv xilinx.com:interface:iic_rtl:1.0 IIC_0
create_bd_intf_pin -mode Slave -vlnv xilinx.com:interface:aximm_rtl:1.0 S_AXI
create_bd_intf_pin -mode Slave -vlnv xilinx.com:interface:aximm_rtl:1.0 S_AXI1
create_bd_intf_pin -mode Slave -vlnv xilinx.com:interface:aximm_rtl:1.0 S_AXI2
create_bd_intf_pin -mode Slave -vlnv xilinx.com:interface:aximm_rtl:1.0 S_AXI3
create_bd_intf_pin -mode Master -vlnv xilinx.com:interface:iic_rtl:1.0 iic_rtl_0
create_bd_intf_pin -mode Master -vlnv xilinx.com:interface:iic_rtl:1.0 iic_rtl_1
create_bd_intf_pin -mode Master -vlnv xilinx.com:interface:iic_rtl:1.0 iic_rtl_2
create_bd_intf_pin -mode Master -vlnv xilinx.com:interface:iic_rtl:1.0 IIC_1
create_bd_intf_pin -mode Slave -vlnv xilinx.com:interface:aximm_rtl:1.0 S_AXI4
create_bd_pin -dir O -type intr iic2intc_irpt
create_bd_pin -dir O -type intr iic2intc_irpt1
create_bd_pin -dir O -type intr iic2intc_irpt2
create_bd_pin -dir O -type intr iic2intc_irpt3
create_bd_pin -dir I -type clk s_axi_aclk
create_bd_pin -dir I -type rst s_axi_aresetn
create_bd_pin -dir O -from 0 -to 0 -type intr iic2intc_irpt4

create_bd_cell -type ip -vlnv xilinx.com:ip:axi_iic:2.1 axi_iic_0
set_property -dict {CONFIG.C_SCL_INERTIAL_DELAY 10 CONFIG.C_SDA_INERTIAL_DELAY 10} [get_bd_cells axi_iic_0]
create_bd_cell -type ip -vlnv xilinx.com:ip:axi_iic:2.1 axi_iic_1
set_property -dict {CONFIG.C_SCL_INERTIAL_DELAY 10 CONFIG.C_SDA_INERTIAL_DELAY 10} [get_bd_cells axi_iic_1]
create_bd_cell -type ip -vlnv xilinx.com:ip:axi_iic:2.1 axi_iic_2
set_property -dict {CONFIG.C_SCL_INERTIAL_DELAY 10 CONFIG.C_SDA_INERTIAL_DELAY 10} [get_bd_cells axi_iic_2]
create_bd_cell -type ip -vlnv xilinx.com:ip:axi_iic:2.1 axi_iic_3
set_property -dict {CONFIG.C_SCL_INERTIAL_DELAY 10 CONFIG.C_SDA_INERTIAL_DELAY 10} [get_bd_cells axi_iic_3]
create_bd_cell -type ip -vlnv xilinx.com:ip:axi_iic:2.1 axi_iic_4
set_property -dict {CONFIG.C_SCL_INERTIAL_DELAY 10 CONFIG.C_SDA_INERTIAL_DELAY 10} [get_bd_cells axi_iic_4]

# ---- hierarchy /registers ----
current_bd_instance /registers
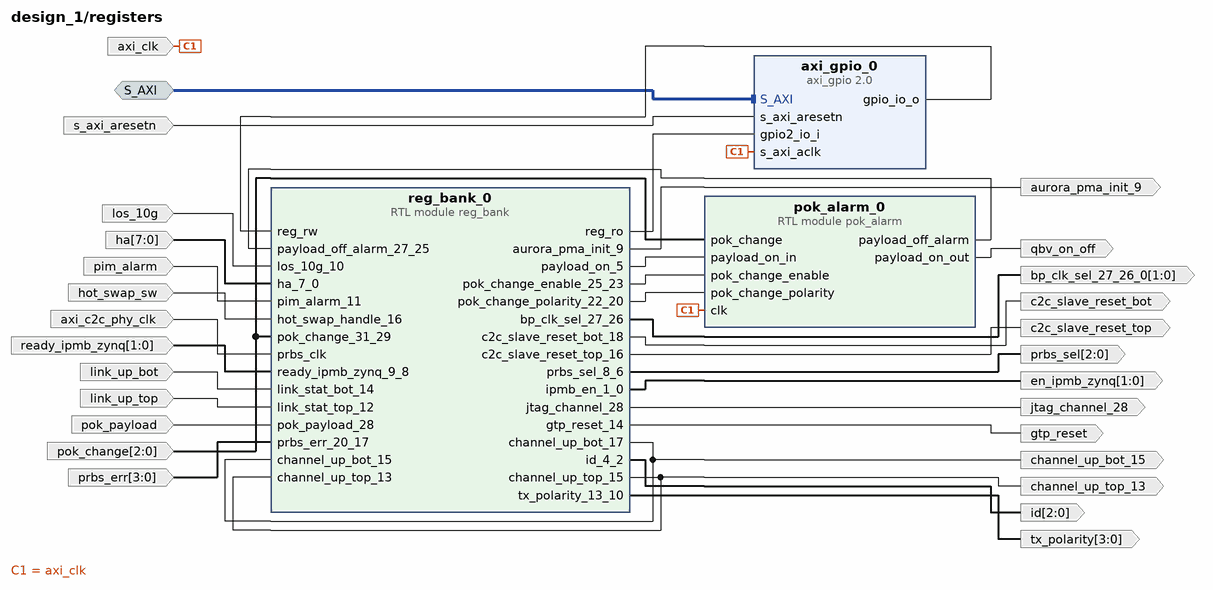
[diagram p8: block diagram inside /registers]
create_bd_intf_pin -mode Slave -vlnv xilinx.com:interface:aximm_rtl:1.0 S_AXI
create_bd_pin -dir O aurora_pma_init_9
create_bd_pin -dir I -type clk axi_c2c_phy_clk
create_bd_pin -dir I -type clk axi_clk
create_bd_pin -dir O -from 1 -to 0 bp_clk_sel_27_26_0
create_bd_pin -dir O c2c_slave_reset_bot
create_bd_pin -dir O c2c_slave_reset_top
create_bd_pin -dir O channel_up_bot_15
create_bd_pin -dir O channel_up_top_13
create_bd_pin -dir O -from 1 -to 0 en_ipmb_zynq
create_bd_pin -dir O gtp_reset
create_bd_pin -dir I -from 7 -to 0 ha
create_bd_pin -dir I hot_swap_sw
create_bd_pin -dir O -from 2 -to 0 id
create_bd_pin -dir I link_up_bot
create_bd_pin -dir I link_up_top
create_bd_pin -dir I los_10g
create_bd_pin -dir I pim_alarm
create_bd_pin -dir I -from 2 -to 0 pok_change
create_bd_pin -dir I pok_payload
create_bd_pin -dir I -from 3 -to 0 prbs_err
create_bd_pin -dir O -from 2 -to 0 prbs_sel
create_bd_pin -dir O qbv_on_off
create_bd_pin -dir I -from 1 -to 0 ready_ipmb_zynq
create_bd_pin -dir I -type rst s_axi_aresetn
create_bd_pin -dir O -from 3 -to 0 tx_polarity
create_bd_pin -dir O jtag_channel_28

create_bd_cell -type module -reference pok_alarm pok_alarm_0
create_bd_cell -type module -reference reg_bank reg_bank_0
create_bd_cell -type ip -vlnv xilinx.com:ip:axi_gpio:2.0 axi_gpio_0
set_property -dict [list \
  CONFIG.C_ALL_INPUTS_2 1 \
  CONFIG.C_ALL_OUTPUTS 1 \
  CONFIG.C_DOUT_DEFAULT 0x00000000 \
  CONFIG.C_GPIO2_WIDTH 32 \
  CONFIG.C_GPIO_WIDTH 29 \
  CONFIG.C_IS_DUAL 1 \
] [get_bd_cells axi_gpio_0]

# ---- hierarchy /hier_0 ----
current_bd_instance /hier_0
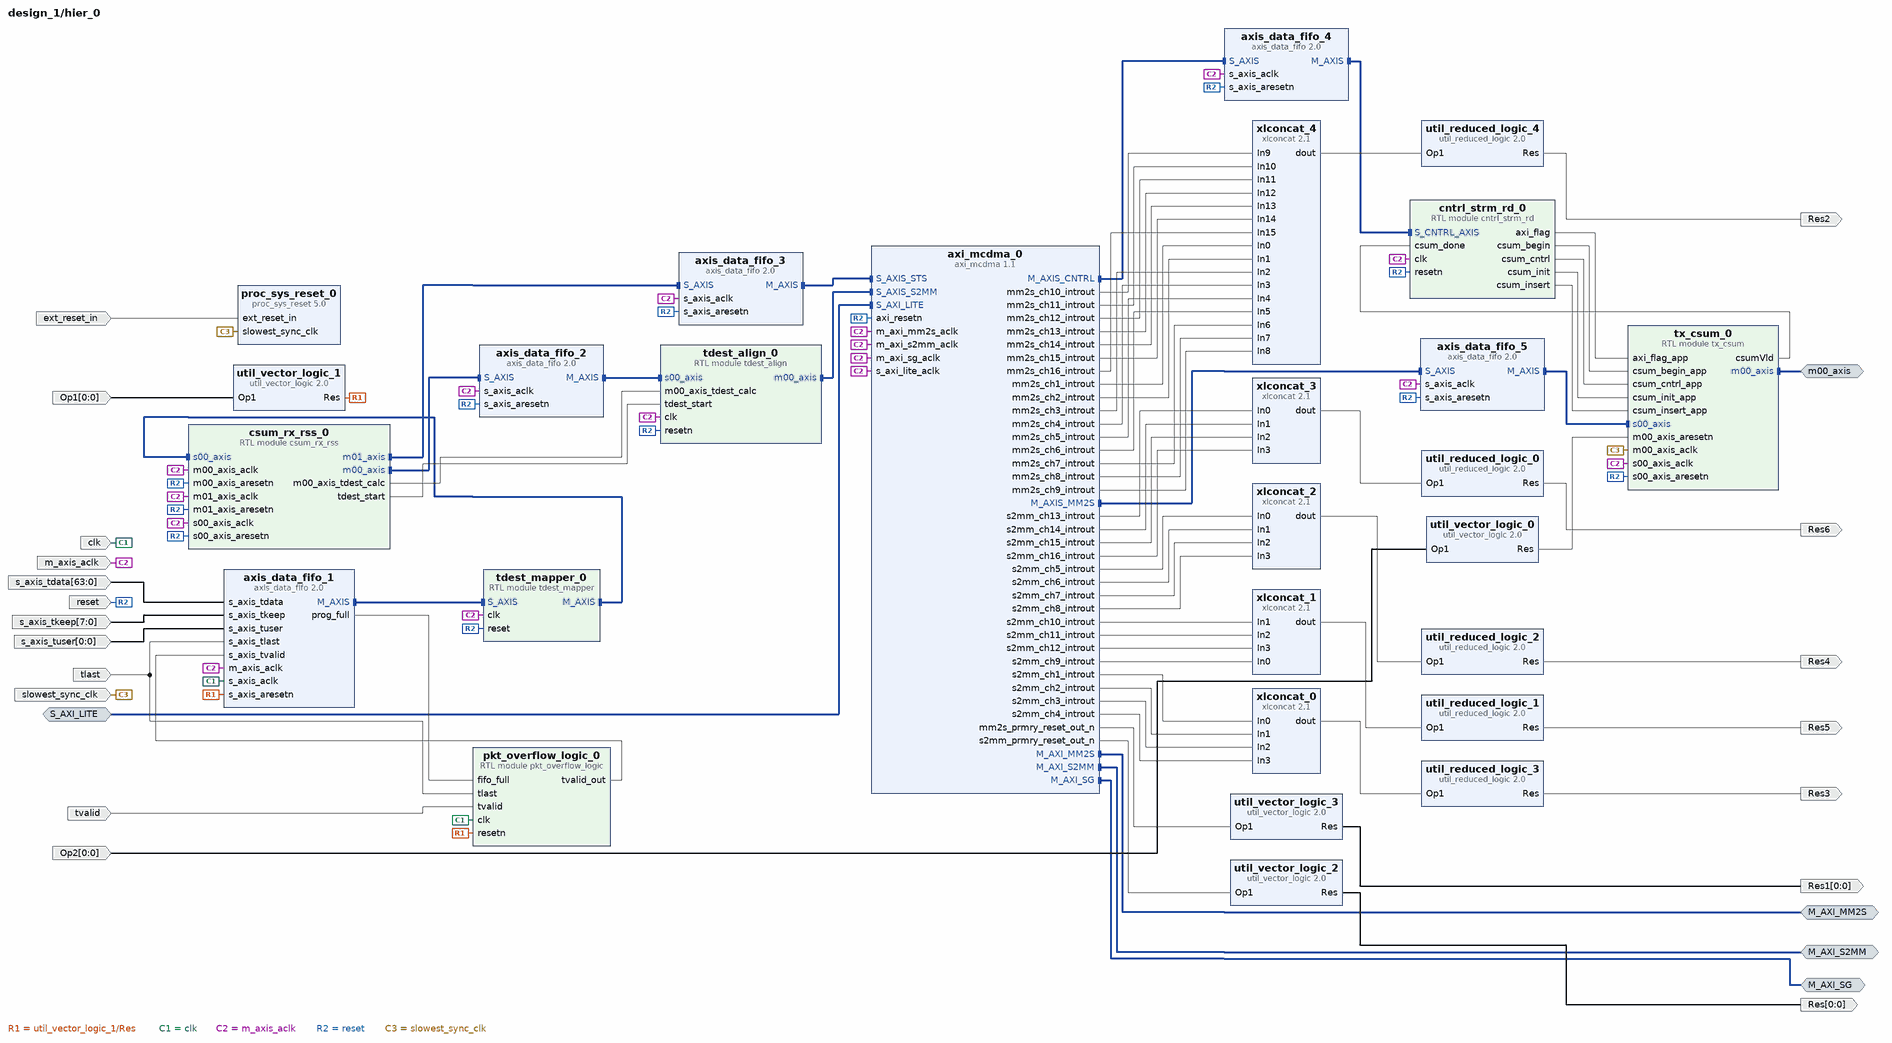
[diagram p9: block diagram inside /hier_0]
create_bd_intf_pin -mode Master -vlnv xilinx.com:interface:aximm_rtl:1.0 M_AXI_S2MM
create_bd_intf_pin -mode Master -vlnv xilinx.com:interface:aximm_rtl:1.0 M_AXI_MM2S
create_bd_intf_pin -mode Master -vlnv xilinx.com:interface:aximm_rtl:1.0 M_AXI_SG
create_bd_intf_pin -mode Master -vlnv xilinx.com:interface:axis_rtl:1.0 m00_axis
create_bd_intf_pin -mode Slave -vlnv xilinx.com:interface:aximm_rtl:1.0 S_AXI_LITE
create_bd_pin -dir I -type clk m_axis_aclk
create_bd_pin -dir I -type rst ext_reset_in
create_bd_pin -dir I -type rst reset
create_bd_pin -dir I -type clk clk
create_bd_pin -dir O -from 0 -to 0 Res
create_bd_pin -dir O -from 0 -to 0 Res1
create_bd_pin -dir I -from 63 -to 0 s_axis_tdata
create_bd_pin -dir I tlast
create_bd_pin -dir I -from 7 -to 0 s_axis_tkeep
create_bd_pin -dir I tvalid
create_bd_pin -dir I -from 0 -to 0 s_axis_tuser
create_bd_pin -dir I -type clk slowest_sync_clk
create_bd_pin -dir I -from 0 -to 0 Op1
create_bd_pin -dir I -from 0 -to 0 Op2
create_bd_pin -dir O Res2
create_bd_pin -dir O Res3
create_bd_pin -dir O Res4
create_bd_pin -dir O Res5
create_bd_pin -dir O Res6

create_bd_cell -type module -reference cntrl_strm_rd cntrl_strm_rd_0
create_bd_cell -type module -reference csum_rx_rss csum_rx_rss_0
create_bd_cell -type module -reference pkt_overflow_logic pkt_overflow_logic_0
create_bd_cell -type ip -vlnv xilinx.com:ip:proc_sys_reset:5.0 proc_sys_reset_0
create_bd_cell -type module -reference tdest_align tdest_align_0
create_bd_cell -type module -reference tdest_mapper tdest_mapper_0
set_property -dict {CONFIG.TDATA_WIDTH 64} [get_bd_cells tdest_mapper_0]
create_bd_cell -type ip -vlnv xilinx.com:ip:util_reduced_logic:2.0 util_reduced_logic_0
set_property -dict {CONFIG.C_OPERATION or CONFIG.C_SIZE 4} [get_bd_cells util_reduced_logic_0]
create_bd_cell -type ip -vlnv xilinx.com:ip:util_reduced_logic:2.0 util_reduced_logic_1
set_property -dict {CONFIG.C_OPERATION or CONFIG.C_SIZE 4} [get_bd_cells util_reduced_logic_1]
create_bd_cell -type ip -vlnv xilinx.com:ip:util_reduced_logic:2.0 util_reduced_logic_2
set_property -dict {CONFIG.C_OPERATION or CONFIG.C_SIZE 4} [get_bd_cells util_reduced_logic_2]
create_bd_cell -type ip -vlnv xilinx.com:ip:util_reduced_logic:2.0 util_reduced_logic_3
set_property -dict {CONFIG.C_OPERATION or CONFIG.C_SIZE 4} [get_bd_cells util_reduced_logic_3]
create_bd_cell -type ip -vlnv xilinx.com:ip:util_reduced_logic:2.0 util_reduced_logic_4
set_property -dict {CONFIG.C_OPERATION or CONFIG.C_SIZE 16} [get_bd_cells util_reduced_logic_4]
create_bd_cell -type ip -vlnv xilinx.com:ip:util_vector_logic:2.0 util_vector_logic_0
set_property -dict {CONFIG.C_OPERATION not CONFIG.C_SIZE 1} [get_bd_cells util_vector_logic_0]
create_bd_cell -type ip -vlnv xilinx.com:ip:util_vector_logic:2.0 util_vector_logic_1
set_property -dict {CONFIG.C_OPERATION not CONFIG.C_SIZE 1} [get_bd_cells util_vector_logic_1]
create_bd_cell -type ip -vlnv xilinx.com:ip:util_vector_logic:2.0 util_vector_logic_2
set_property -dict {CONFIG.C_OPERATION not CONFIG.C_SIZE 1} [get_bd_cells util_vector_logic_2]
create_bd_cell -type ip -vlnv xilinx.com:ip:util_vector_logic:2.0 util_vector_logic_3
set_property -dict {CONFIG.C_OPERATION not CONFIG.C_SIZE 1} [get_bd_cells util_vector_logic_3]
create_bd_cell -type ip -vlnv xilinx.com:ip:xlconcat:2.1 xlconcat_0
set_property -dict {CONFIG.NUM_PORTS 4} [get_bd_cells xlconcat_0]
create_bd_cell -type ip -vlnv xilinx.com:ip:xlconcat:2.1 xlconcat_1
set_property -dict {CONFIG.NUM_PORTS 4} [get_bd_cells xlconcat_1]
create_bd_cell -type ip -vlnv xilinx.com:ip:xlconcat:2.1 xlconcat_2
set_property -dict {CONFIG.NUM_PORTS 4} [get_bd_cells xlconcat_2]
create_bd_cell -type ip -vlnv xilinx.com:ip:xlconcat:2.1 xlconcat_3
set_property -dict {CONFIG.NUM_PORTS 4} [get_bd_cells xlconcat_3]
create_bd_cell -type ip -vlnv xilinx.com:ip:xlconcat:2.1 xlconcat_4
set_property -dict {CONFIG.NUM_PORTS 16} [get_bd_cells xlconcat_4]
create_bd_cell -type ip -vlnv xilinx.com:ip:axi_mcdma:1.1 axi_mcdma_0
set_property -dict [list \
  CONFIG.c_addr_width 64 \
  CONFIG.c_group1_mm2s 1111111111111111 \
  CONFIG.c_group1_s2mm 1111111111111111 \
  CONFIG.c_include_mm2s_dre 1 \
  CONFIG.c_include_s2mm_dre 1 \
  CONFIG.c_m_axi_mm2s_data_width 128 \
  CONFIG.c_m_axi_s2mm_data_width 128 \
  CONFIG.c_m_axis_mm2s_tdata_width 64 \
  CONFIG.c_mm2s_burst_size 256 \
  CONFIG.c_mm2s_scheduler 1 \
  CONFIG.c_num_mm2s_channels 16 \
  CONFIG.c_num_s2mm_channels 16 \
  CONFIG.c_prmry_is_aclk_async 1 \
  CONFIG.c_s2mm_burst_size 256 \
  CONFIG.c_sg_include_stscntrl_strm 1 \
  CONFIG.c_sg_length_width 23 \
] [get_bd_cells axi_mcdma_0]
create_bd_cell -type ip -vlnv xilinx.com:ip:axis_data_fifo:2.0 axis_data_fifo_1
set_property -dict [list \
  CONFIG.FIFO_DEPTH 8192 \
  CONFIG.HAS_PROG_FULL 1 \
  CONFIG.HAS_RD_DATA_COUNT 1 \
  CONFIG.HAS_TKEEP 1 \
  CONFIG.HAS_TLAST 1 \
  CONFIG.HAS_WR_DATA_COUNT 1 \
  CONFIG.IS_ACLK_ASYNC 1 \
  CONFIG.PROG_FULL_THRESH 4091 \
  CONFIG.TDATA_NUM_BYTES 8 \
  CONFIG.TUSER_WIDTH 1 \
] [get_bd_cells axis_data_fifo_1]
create_bd_cell -type ip -vlnv xilinx.com:ip:axis_data_fifo:2.0 axis_data_fifo_2
set_property -dict {CONFIG.FIFO_DEPTH 8192 CONFIG.HAS_TLAST 1} [get_bd_cells axis_data_fifo_2]
create_bd_cell -type ip -vlnv xilinx.com:ip:axis_data_fifo:2.0 axis_data_fifo_3
set_property -dict [list \
  CONFIG.FIFO_DEPTH 256 \
  CONFIG.HAS_PROG_FULL 1 \
  CONFIG.HAS_RD_DATA_COUNT 1 \
  CONFIG.HAS_WR_DATA_COUNT 1 \
  CONFIG.PROG_FULL_THRESH 192 \
] [get_bd_cells axis_data_fifo_3]
create_bd_cell -type ip -vlnv xilinx.com:ip:axis_data_fifo:2.0 axis_data_fifo_4
set_property -dict [list \
  CONFIG.FIFO_DEPTH 256 \
  CONFIG.HAS_PROG_FULL 1 \
  CONFIG.HAS_RD_DATA_COUNT 1 \
  CONFIG.HAS_WR_DATA_COUNT 1 \
  CONFIG.PROG_FULL_THRESH 192 \
] [get_bd_cells axis_data_fifo_4]
create_bd_cell -type ip -vlnv xilinx.com:ip:axis_data_fifo:2.0 axis_data_fifo_5
set_property -dict [list \
  CONFIG.FIFO_DEPTH 4096 \
  CONFIG.HAS_PROG_FULL 1 \
  CONFIG.HAS_RD_DATA_COUNT 1 \
  CONFIG.HAS_WR_DATA_COUNT 1 \
  CONFIG.PROG_FULL_THRESH 4091 \
] [get_bd_cells axis_data_fifo_5]
create_bd_cell -type module -reference tx_csum tx_csum_0

# ---- connections ----

current_bd_instance /C2C
connect_bd_intf_net [get_bd_intf_pins axi_chip2chip_0/s_axi] [get_bd_intf_pins axisafety_1/M_AXI]
connect_bd_intf_net [get_bd_intf_pins axi_chip2chip_0/s_axi] [get_bd_intf_pins M_AXI]
connect_bd_intf_net [get_bd_intf_pins axi_chip2chip_1/s_axi] [get_bd_intf_pins axisafety_2/M_AXI]
connect_bd_intf_net [get_bd_intf_pins S_AXI1] [get_bd_intf_pins axisafety_2/S_AXI]
connect_bd_intf_net [get_bd_intf_pins S_AXI] [get_bd_intf_pins axisafety_1/S_AXI]
connect_bd_net -net AXIS_RX_0_tvalid_0_1 [get_bd_pins rxvalid_top] [get_bd_pins axi_chip2chip_1/axi_c2c_aurora_rx_tvalid]
connect_bd_net -net AXIS_RX_0_tvalid_1_1 [get_bd_pins rxvalid_bot] [get_bd_pins axi_chip2chip_0/axi_c2c_aurora_rx_tvalid]
connect_bd_net [get_bd_pins axi_clk] \
  [get_bd_pins axi_chip2chip_0/s_aclk] [get_bd_pins axi_chip2chip_0/aurora_init_clk] [get_bd_pins axi_chip2chip_1/s_aclk] \
  [get_bd_pins axi_chip2chip_1/aurora_init_clk] [get_bd_pins axisafety_1/S_AXI_ACLK] [get_bd_pins axisafety_2/S_AXI_ACLK]
connect_bd_net -net aresetn_bot [get_bd_pins axisafety_1/comb_aresetn] [get_bd_pins comb_aresetn] [get_bd_pins axi_chip2chip_0/s_aresetn]
connect_bd_net -net aresetn_top [get_bd_pins axisafety_2/comb_aresetn] [get_bd_pins s_aresetn] [get_bd_pins axi_chip2chip_1/s_aresetn]
connect_bd_net -net aurora_mmcm_not_locked_0_1 [get_bd_pins mgt_unlocked_top] [get_bd_pins axi_chip2chip_1/aurora_mmcm_not_locked]
connect_bd_net -net aurora_mmcm_not_locked_1_1 [get_bd_pins mgt_unlocked_bot] [get_bd_pins axi_chip2chip_0/aurora_mmcm_not_locked]
connect_bd_net -net axi_c2c_phy_clk_0_1 [get_bd_pins axi_c2c_phy_clk] \
  [get_bd_pins axi_chip2chip_0/axi_c2c_phy_clk] [get_bd_pins axi_chip2chip_1/axi_c2c_phy_clk]
connect_bd_net [get_bd_pins axi_chip2chip_0/axi_c2c_aurora_tx_tvalid] [get_bd_pins txvalid_bot]
connect_bd_net [get_bd_pins axi_chip2chip_1/axi_c2c_aurora_tx_tvalid] [get_bd_pins txvalid_top]
connect_bd_net [get_bd_pins axisafety_1/channel_up] [get_bd_pins axi_chip2chip_0/axi_c2c_aurora_channel_up]
connect_bd_net [get_bd_pins axisafety_2/channel_up] [get_bd_pins axi_chip2chip_1/axi_c2c_aurora_channel_up]
connect_bd_net -net chip2chip_bot_ff_aurora_do_cc [get_bd_pins axi_chip2chip_0/aurora_do_cc] [get_bd_pins do_cc_bot]
connect_bd_net -net chip2chip_top_ff_aurora_do_cc [get_bd_pins axi_chip2chip_1/aurora_do_cc] [get_bd_pins do_cc_top]
connect_bd_net -net cpu_peripheral_reset [get_bd_pins aurora_pma_init_in] \
  [get_bd_pins axi_chip2chip_0/aurora_pma_init_in] [get_bd_pins axi_chip2chip_1/aurora_pma_init_in]
connect_bd_net -net link_stat_bot [get_bd_pins axi_chip2chip_0/axi_c2c_link_status_out] [get_bd_pins link_up_bot]
connect_bd_net -net link_stat_top [get_bd_pins axi_chip2chip_1/axi_c2c_link_status_out] [get_bd_pins link_up_top]
connect_bd_net -net proc_sys_reset_0_peripheral_aresetn [get_bd_pins S_AXI_ARESETN] \
  [get_bd_pins axisafety_1/S_AXI_ARESETN] [get_bd_pins axisafety_2/S_AXI_ARESETN]
connect_bd_net -net read_fault_bot [get_bd_pins axisafety_1/o_read_fault] [get_bd_pins o_read_fault]
connect_bd_net -net read_fault_top [get_bd_pins axisafety_2/o_read_fault] [get_bd_pins o_read_fault1]
connect_bd_net -net reg_bank_0_channel_up_bot_17 [get_bd_pins ext_resetn] \
  [get_bd_pins axi_chip2chip_0/axi_c2c_aurora_tx_tready] [get_bd_pins axisafety_1/ext_resetn]
connect_bd_net -net reg_bank_0_channel_up_top_15 [get_bd_pins axi_c2c_aurora_tx_tready] \
  [get_bd_pins axi_chip2chip_1/axi_c2c_aurora_tx_tready] [get_bd_pins axisafety_2/ext_resetn]
connect_bd_net [get_bd_pins rxdata_bot] [get_bd_pins axi_chip2chip_0/axi_c2c_aurora_rx_tdata]
connect_bd_net [get_bd_pins rxdata_top] [get_bd_pins axi_chip2chip_1/axi_c2c_aurora_rx_tdata]
connect_bd_net -net txdata_bot [get_bd_pins axi_chip2chip_0/axi_c2c_aurora_tx_tdata] [get_bd_pins txdata_bot]
connect_bd_net -net txdata_top [get_bd_pins axi_chip2chip_1/axi_c2c_aurora_tx_tdata] [get_bd_pins txdata_top]
connect_bd_net -net write_fault_bot [get_bd_pins axisafety_1/o_write_fault] [get_bd_pins o_write_fault]
connect_bd_net -net write_fault_top [get_bd_pins axisafety_2/o_write_fault] [get_bd_pins o_write_fault1]
